# Altium schematic sheet dali.SchDoc
size A4; DrawnBy: Forrest Gu; DocumentNumber: 2; Revision: 1.0; SheetNumber: 2; SheetTotal: 5
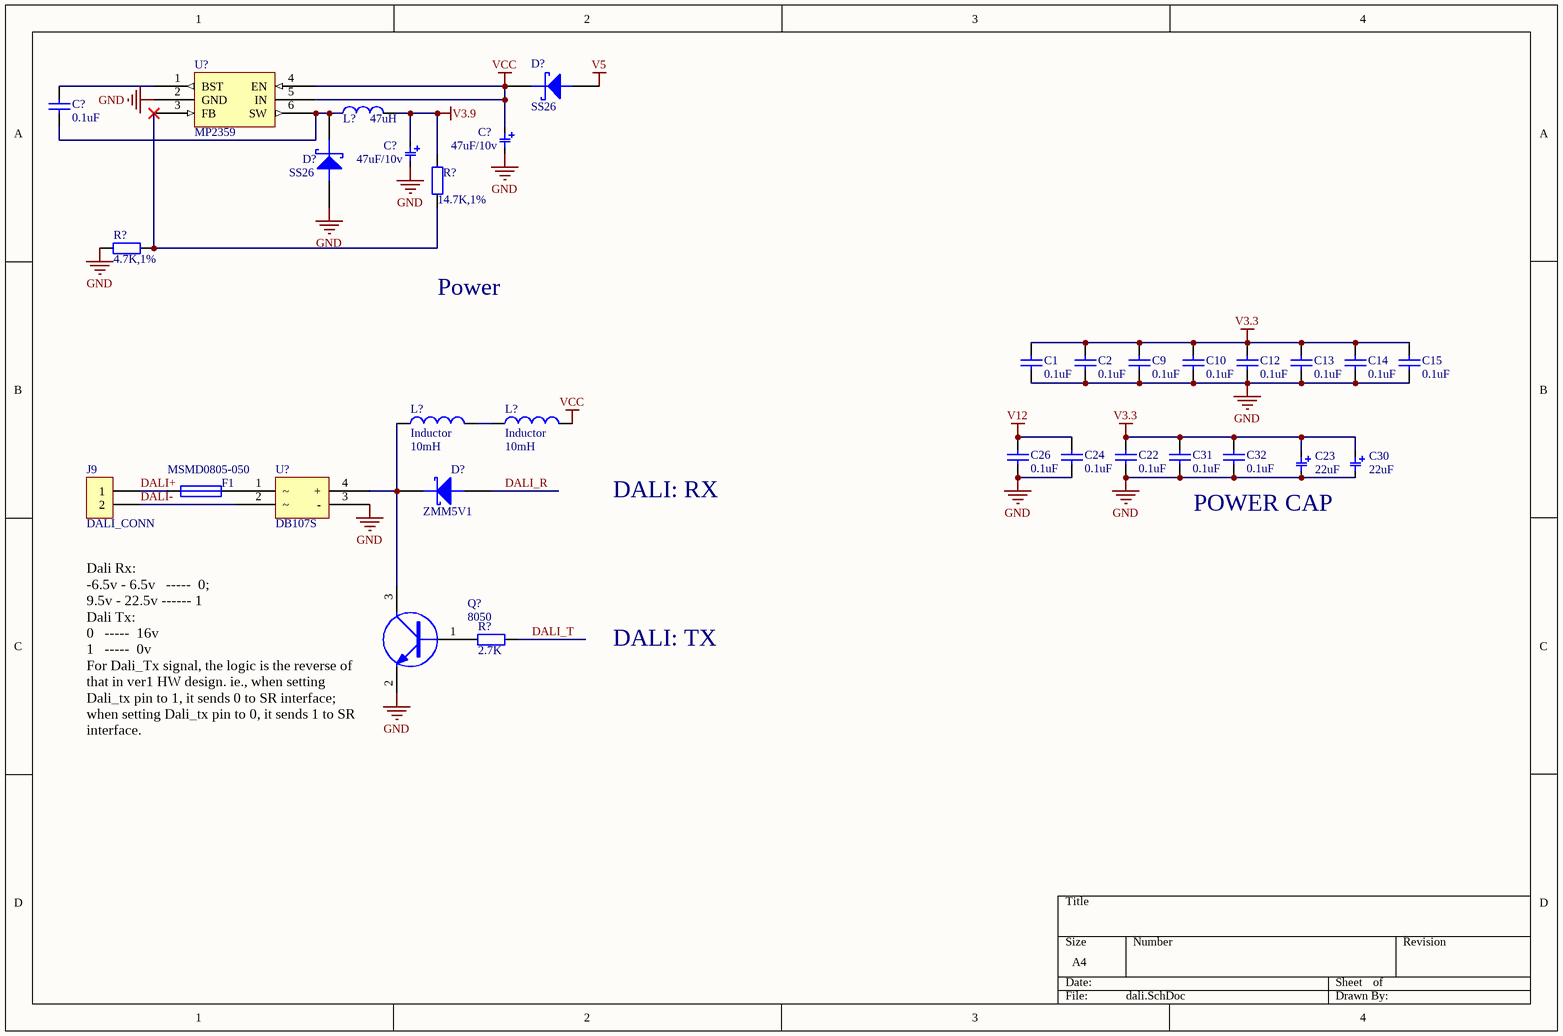
[diagram p0: dali.SchDoc]

## Parts
(Parts that share a designator on the sheet are numbered #1, #2 ... from top to bottom, then left to right.)
C1  0.1uF  [0603]
C2  0.1uF  [0603]
C9  0.1uF  [0603]
C10  0.1uF  [0603]
C12  0.1uF  [0603]
C13  0.1uF  [0603]
C14  0.1uF  [0603]
C15  0.1uF  [0603]
C22  0.1uF  [0603]
C23  22uF  [cap_1206]
C24  0.1uF  [0603]
C26  0.1uF  [0603]
C30  22uF  [cap_1206]
C31  0.1uF  [0603]
C32  0.1uF  [0603]
C?#1  0.1uF  [0603]
C?#2  47uF/10v  [Cap_1206]
C?#3  47uF/10v  [Cap_1206]
D?#1  SS26  [Diode_SMB]
D?#2  SS26  [Diode_SMB]
D?#3  ZMM5V1  [DIODE_1206]
F1  MSMD0805-050  [0805]
J9  DALI_CONN  [2EDG5.08-2P]
L?#1  47uH  [0805]
L?#2  Inductor  value 10mH  [L0608-D5]
L?#3  Inductor  value 10mH  [L0608-D5]
Q?  8050  [SOT-23]
R?#1  14.7K,1%  [0603r]
R?#2  4.7K,1%  [0603r]
R?#3  2.7K  [0603r]
U?#1  MP2359  [TSOT23-6]
U?#2  DB107S  [SOP-4]

## Nets
GND: C1.2 C2.2 C9.2 C10.2 C12.2 C13.2 C14.2 C15.2 C22.2 C23.2 C24.2 C26.2 C30.2 C31.2 C32.2 C?#2.2 C?#3.2 D?#2.1(A) Q?.2(E) R?#2.1 U?#1.2(GND) U?#2.3(-)
V3.3: C1.1 C2.1 C9.1 C10.1 C12.1 C13.1 C14.1 C15.1 C22.1 C23.1 C30.1 C31.1 C32.1
V3.9: C?#3.1 L?#1.1 R?#1.1
V5: D?#1.1(A)
V12: C24.1 C26.1
VCC: C?#2.1 D?#1.2(K) L?#3.2 U?#1.4(EN) U?#1.5(IN)
DALI+: F1.1 J9.1
DALI-: J9.2 U?#2.2
DALI_R: D?#3.1(A)
DALI_T: R?#3.1
NetC?#1_1: C?#1.1 D?#2.2(K) L?#1.2 U?#1.6(SW)
NetC?#1_2: C?#1.2 U?#1.1(BST)
NetD?#3_2: D?#3.2(K) L?#2.1 Q?.3(C) U?#2.4(+)
NetF1_2: F1.2 U?#2.1
NetL?#2_2: L?#2.2 L?#3.1
NetQ?_1: Q?.1(B) R?#3.2
NetR?#1_2: R?#1.2 R?#2.2 U?#1.3(FB)

## Notes on the sheet
- Power
- DALI: RX
- POWER CAP
- DALI: TX
- Dali Rx:
  -6.5v - 6.5v   -----  0;
  9.5v - 22.5v ------ 1
  Dali Tx:
  0   -----  16v
  1   -----  0v
  For Dali_Tx signal, the logic is the reverse of that in ver1 HW design. ie., when setting Dali_tx pin to 1, it sends 0 to SR interface; when setting Dali_tx pin to 0, it sends 1 to SR interface.

## Library data of the parts
C1 C2 C9 C10 C12-C15 C22 C24 C26 C31 C32 C?#1 = Cap: Capacitor; Published: 8-Jun-2000; LatestRevisionDate: 17-Jul-2002; LatestRevisionNote: Re-released for DXP Platform.; PackageReference: RAD-0.3; Publisher: Altium Limited; Value: 0.1uF
C23 C30 C?#2 C?#3 = ECAP
D?#1 D?#2 = SchottkyDiode: Schottky Diode
D?#3 = DIODE SCHOTTKY: Schottky Diode
F1 = FUSE
J9 = CON2
L?#1 = L: 叠层电感
L?#2 L?#3 = Inductor: Code_IEC: 1005; Published: 8-Jun-2000; LatestRevisionDate: 29-May-2009; LatestRevisionNote: IPC-7351 Footprint Added.; PackageReference: 0402-A; Publisher: Altium Limited; PackageDescription: Chip Inductor; Code_JEITA: 0402
Q? = NPN: NPN Transistor
R?#1-R?#3 = Res2: Resistor; Value: 1K; Published: 8-Jun-2000; LatestRevisionDate: 17-Jul-2002; LatestRevisionNote: Re-released for DXP Platform.; PackageReference: AXIAL-0.4; Publisher: Altium Limited
U?#1 = MP2359: Power Convertor
U?#2 = MB4S